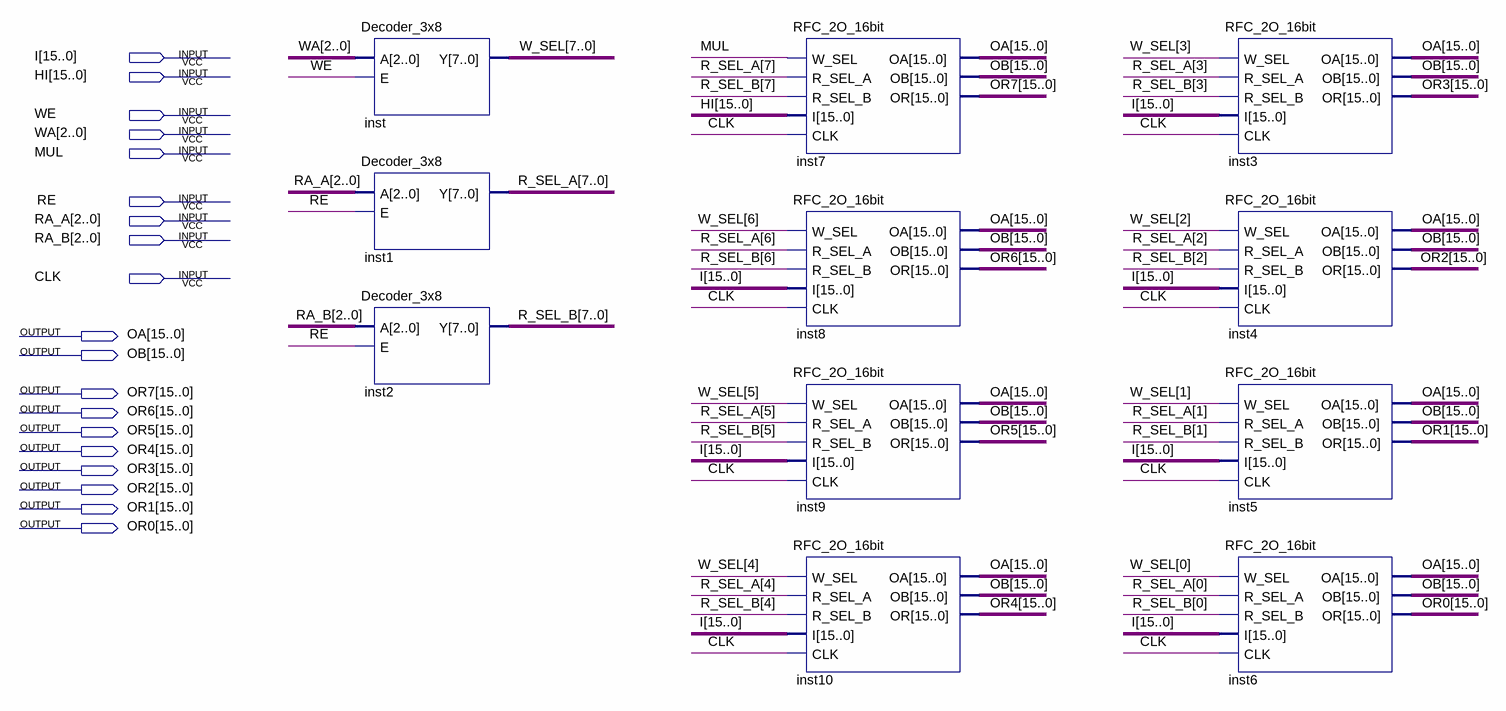
[diagram p0: schematic sheet]
// Quartus schematic RF_2O_8x16.bdf as structural Verilog: 11 symbols, 19 pins
module RF_2O_8x16 (
  input  [15:0] I,
  input  [15:0] HI,
  input  WE,
  input  [2:0] WA,
  input  MUL,
  input  RE,
  input  [2:0] RA_A,
  input  [2:0] RA_B,
  input  CLK,
  output [15:0] OA,
  output [15:0] OB,
  output [15:0] OR7,
  output [15:0] OR6,
  output [15:0] OR5,
  output [15:0] OR4,
  output [15:0] OR3,
  output [15:0] OR2,
  output [15:0] OR1,
  output [15:0] OR0
);

  wire [7:0] R_SEL_A, R_SEL_B, W_SEL;

  Decoder_3x8 inst (.A(WA), .E(WE), .Y(W_SEL));
  Decoder_3x8 inst1 (.A(RA_A), .E(RE), .Y(R_SEL_A));
  Decoder_3x8 inst2 (.A(RA_B), .E(RE), .Y(R_SEL_B));
  RFC_2O_16bit inst7 (
    .W_SEL(MUL), .R_SEL_A(R_SEL_A[7]), .R_SEL_B(R_SEL_B[7]), .I(HI), .CLK(CLK), .OA(OA), .OB(OB), .OR(OR7));
  RFC_2O_16bit inst8 (
    .W_SEL(W_SEL[6]), .R_SEL_A(R_SEL_A[6]), .R_SEL_B(R_SEL_B[6]), .I(I), .CLK(CLK), .OA(OA), .OB(OB), .OR(OR6));
  RFC_2O_16bit inst9 (
    .W_SEL(W_SEL[5]), .R_SEL_A(R_SEL_A[5]), .R_SEL_B(R_SEL_B[5]), .I(I), .CLK(CLK), .OA(OA), .OB(OB), .OR(OR5));
  RFC_2O_16bit inst10 (
    .W_SEL(W_SEL[4]), .R_SEL_A(R_SEL_A[4]), .R_SEL_B(R_SEL_B[4]), .I(I), .CLK(CLK), .OA(OA), .OB(OB), .OR(OR4));
  RFC_2O_16bit inst3 (
    .W_SEL(W_SEL[3]), .R_SEL_A(R_SEL_A[3]), .R_SEL_B(R_SEL_B[3]), .I(I), .CLK(CLK), .OA(OA), .OB(OB), .OR(OR3));
  RFC_2O_16bit inst4 (
    .W_SEL(W_SEL[2]), .R_SEL_A(R_SEL_A[2]), .R_SEL_B(R_SEL_B[2]), .I(I), .CLK(CLK), .OA(OA), .OB(OB), .OR(OR2));
  RFC_2O_16bit inst5 (
    .W_SEL(W_SEL[1]), .R_SEL_A(R_SEL_A[1]), .R_SEL_B(R_SEL_B[1]), .I(I), .CLK(CLK), .OA(OA), .OB(OB), .OR(OR1));
  RFC_2O_16bit inst6 (
    .W_SEL(W_SEL[0]), .R_SEL_A(R_SEL_A[0]), .R_SEL_B(R_SEL_B[0]), .I(I), .CLK(CLK), .OA(OA), .OB(OB), .OR(OR0));
endmodule
